# EAGLE design NobleAward_Rhodium (EAGLE 9.6.2)
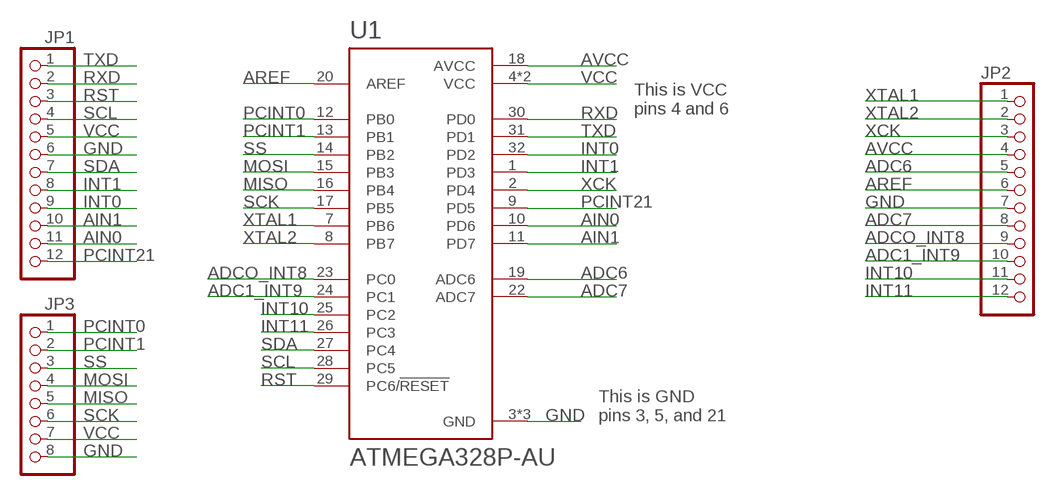
[diagram p0: schematic, sheet 1]

## Parts
JP1  PINHD-1X12  [1X12]
JP2  PINHD-1X12  [1X12]
JP3  PINHD-1X8  [1X08]
U1  ATMEGA328P-AU  [QFP80P900X900X120-32N]

## Nets
ADC1_INT9: JP2.10 U1.24(PC1)
ADC6: JP2.5 U1.19(ADC6)
ADC7: JP2.8 U1.22(ADC7)
ADCO_INT8: JP2.9 U1.23(PC0)
AIN0: JP1.11 U1.10(PD6)
AIN1: JP1.10 U1.11(PD7)
AREF: JP2.6 U1.20(AREF)
AVCC: JP2.4 U1.18(AVCC)
GND: JP1.6 JP2.7 JP3.8 U1.3(GND) U1.5(GND) U1.21(GND)
INT0: JP1.9 U1.32(PD2)
INT1: JP1.8 U1.1(PD3)
INT10: JP2.11 U1.25(PC2)
INT11: JP2.12 U1.26(PC3)
MISO: JP3.5 U1.16(PB4)
MOSI: JP3.4 U1.15(PB3)
PCINT0: JP3.1 U1.12(PB0)
PCINT1: JP3.2 U1.13(PB1)
PCINT21: JP1.12 U1.9(PD5)
RST: JP1.3 U1.29(PC6/!RESET)
RXD: JP1.2 U1.30(PD0)
SCK: JP3.6 U1.17(PB5)
SCL: JP1.4 U1.28(PC5)
SDA: JP1.7 U1.27(PC4)
SS: JP3.3 U1.14(PB2)
TXD: JP1.1 U1.31(PD1)
VCC: JP1.5 JP3.7 U1.4(VCC) U1.6(VCC)
XCK: JP2.3 U1.2(PD4)
XTAL1: JP2.1 U1.7(PB6)
XTAL2: JP2.2 U1.8(PB7)

## Notes on the sheet
- This is VCC
  pins 4 and 6
- This is GND
  pins 3, 5, and 21

## Library data of the parts
JP1 JP2 = pinhead:PINHD-1X12: PIN HEADER
JP3 = pinhead:PINHD-1X8: PIN HEADER
U1 = ATMEGA328P-AU:ATMEGA328P-AU: ATmega Series 20 MHz 32 KB Flash 2 KB SRAM 8-Bit Microcontroller - TQFP-32; AVAILABILITY: Unavailable; DESCRIPTION: AVR AVR® ATmega Microcontroller IC 8-Bit 20MHz 32KB _16K x 16_ FLASH 32-TQFP _7x7_; MF: Microchip; MP: ATMEGA328P-AU; PACKAGE: TQFP-32 Microchip; PRICE: None

## Board
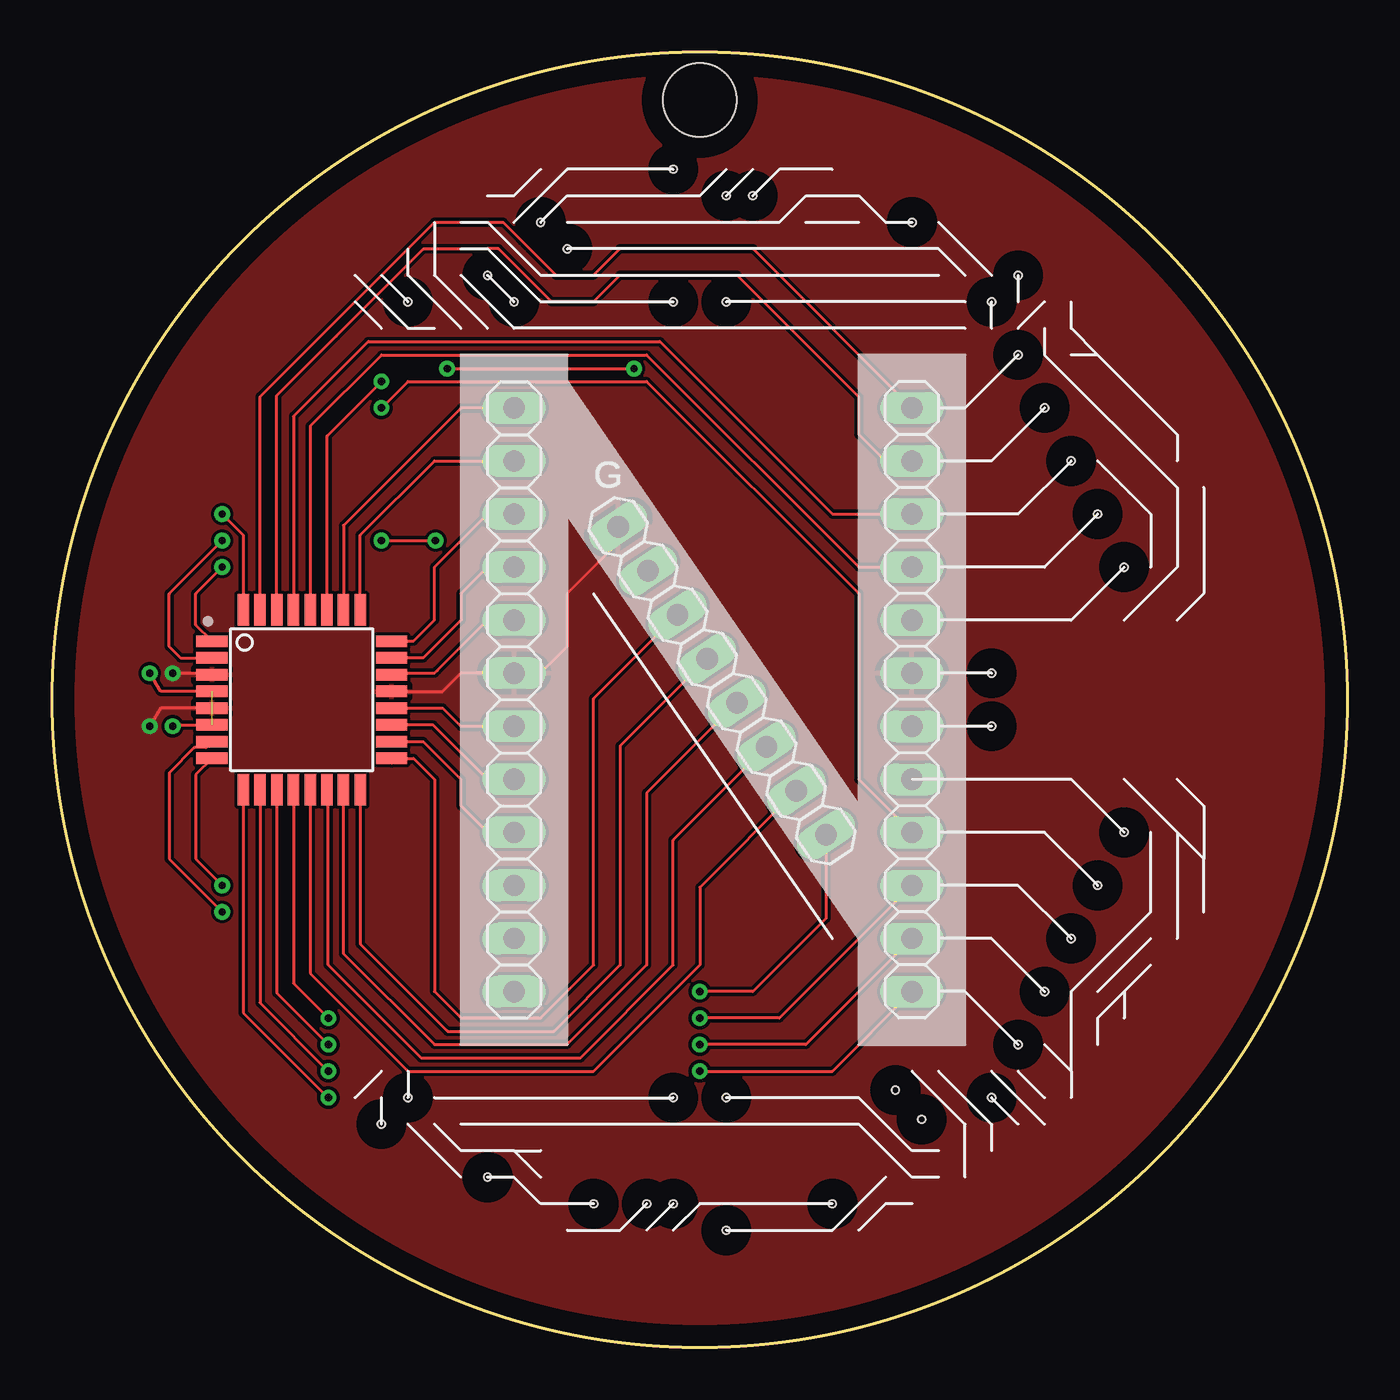
[diagram p1: board, top side]
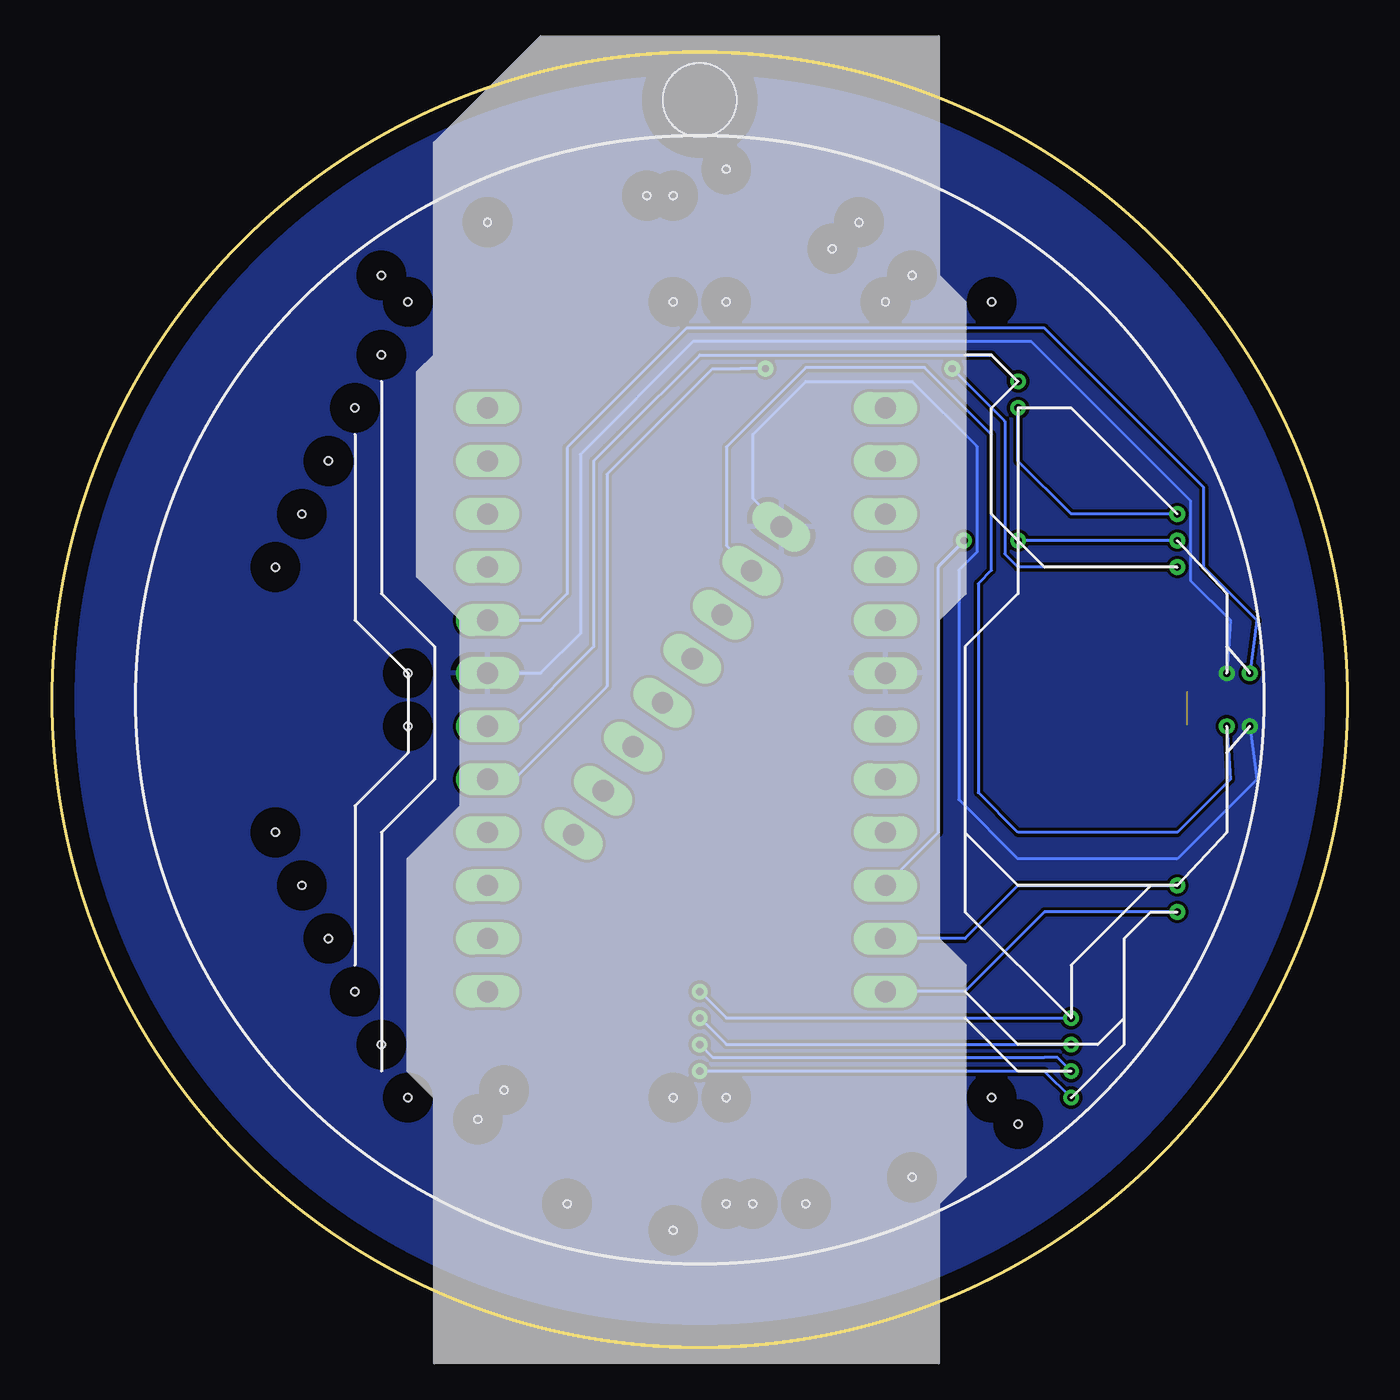
[diagram p2: board, bottom side, seen from below]

Size 62 x 62 mm. Coordinates in mm from the lower left corner, seen from the top.
Outline: circle at 31,31 radius 31
Copper layers (1*16): Top 0.035mm / dielectric 1.5mm / Bottom 0.035mm
Design rules "default": minimum track width 6mil, minimum drill 0.35mm, track to track 6mil, track to pad 6mil, pad to pad 6mil, via to via 6mil, smd to smd 6mil, copper to edge 40mil, drill to drill 6mil, minimum pad ring 10mil, minimum via ring 8mil, stop-mask expansion 4mil, vias tented up to drill 0mil, thermal gap 10mil
Holes 0.35 mm at 24.65,52.59 41.16,53.86 23.38,53.86 33.54,55.13 32.27,55.13 22.11,50.05 29.73,50.05 32.27,50.05 29.73,56.4 20.84,51.32 17.03,50.05 44.97,50.05 46.24,51.32 20.84,8.14 28.46,6.87 29.73,6.87 40.37,12.31 32.27,11.95 29.73,11.95 32.27,5.6 41.62,10.91 44.97,11.95 17.03,11.95 15.76,10.68 25.92,6.87 37.35,6.87 46.24,47.51 47.51,44.97 48.78,42.43 50.05,39.89 51.32,37.35 44.97,32.27 44.97,29.73 51.32,24.65 50.05,22.11 48.78,19.57 47.51,17.03 46.24,14.49
Holes 3.5 mm at 31,59.71

### Footprints (pad centres in the part's own frame; a part is rotated, then mirrored left to right if it is on the bottom)
1X12 = drill 1.016 long: 1 -13.97,0; 2 -11.43,0; 3 -8.89,0; 4 -6.35,0; 5 -3.81,0; 6 -1.27,0; 7 1.27,0; 8 3.81,0; 9 6.35,0; 10 8.89,0; 11 11.43,0; 12 13.97,0
1X08 = drill 1.016 long: 1 -8.89,0; 2 -6.35,0; 3 -3.81,0; 4 -1.27,0; 5 1.27,0; 6 3.81,0; 7 6.35,0; 8 8.89,0
QFP80P900X900X120-32N = smd 1.5 x 0.55: 1 -4.3,2.8; 2 -4.3,2; 3 -4.3,1.2; 4 -4.3,0.4; 5 -4.3,-0.4; 6 -4.3,-1.2; 7 -4.3,-2; 8 -4.3,-2.8; 17 4.3,-2.8; 18 4.3,-2; 19 4.3,-1.2; 20 4.3,-0.4; 21 4.3,0.4; 22 4.3,1.2; 23 4.3,2; 24 4.3,2.8 | smd 0.55 x 1.5: 9 -2.8,-4.3; 10 -2,-4.3; 11 -1.2,-4.3; 12 -0.4,-4.3; 13 0.4,-4.3; 14 1.2,-4.3; 15 2,-4.3; 16 2.8,-4.3; 25 2.8,4.3; 26 2,4.3; 27 1.2,4.3; 28 0.4,4.3; 29 -0.4,4.3; 30 -1.2,4.3; 31 -2,4.3; 32 -2.8,4.3

### Placement (x,y rotation side)
JP1  41.16,31 270 top
JP2  22.11,31 90 top
JP3  32.07,31.91 124 top
U1  11.95,31 0 top

### Tracks (layer width: path | path; a pad name or v marks a point on that pad's centre or on a via)
ADC1_INT9
  Top 0.152: 16.98,33.8 U1.24 17.29,33.8 18.3,34.81 18.3,37.35 20.84,39.89 JP2.10
ADC6
  Top 0.152: U1.19 18.23,29.8 20.84,27.19 JP2.5
ADC7
  Top 0.152: JP2.8 20.84,34.81 18.43,32.4 18.3,32.27 16.32,32.27 U1.22
ADCO_INT8
  Top 0.152: U1.23 17.76,33 19.57,34.81 19.57,36.08 20.84,37.35 JP2.9
AIN0  (via drill 0.35)
  Top 0.152: U1.10 9.95,16.49 v13.22,13.22 | JP1.11 36.08,14.49 v31,14.49
  Bottom 0.152: v31,14.49 30.39,13.88 14.49,13.88 13.88,13.88 v13.22,13.22
AIN1  (via drill 0.35)
  Top 0.152: U1.11 10.75,16.96 11.95,15.76 v13.22,14.49 | JP1.10 34.81,15.76 v31,15.76
  Bottom 0.152: v31,15.76 29.73,14.49 v13.22,14.49
AREF
  Top 0.152: U1.20 18.7,30.6 19.57,29.73 JP2.6
AVCC
  Top 0.152: U1.18 17.76,29 18.3,28.46 19.57,27.19 19.57,25.92 20.84,24.65 JP2.4
GND  (via drill 0.35)
  Top 0.152: U1.5 5.2,30.6 v4.67,29.73 | U1.21 18.7,31.4 19.57,32.27 JP2.7 23.38,32.27 24.65,33.54 24.65,36.08 27.1,38.53 JP3.8 | v5.77,32.27 7.58,32.27 U1.3
  Bottom 0.152: v5.77,32.27 5.6,34.81 7.51,36.72 7.51,40.52 15.13,48.15 31.32,48.15 36.72,42.75 36.72,34.18 38.62,32.27 JP1.6 | v4.67,29.73 4.33,27.19 8.14,23.38 15.76,23.38 18.61,26.23 18.61,37.2 17.74,38.06 17.74,43.14 20.84,46.24 25.92,46.24 28.46,43.7 28.46,40.64 JP3.8
  pour Bottom: 17.03,62.75 47.51,62.75 50.05,60.21 62.75,47.51 62.75,19.57 62.75,17.03 44.97,-0.75 19.57,-0.75 15.76,-0.75 -2.02,17.03 -2.02,20.84 -2.02,44.97 15.76,62.75
  pour Top: 13.22,62.75 46.24,62.75 62.75,46.24 62.75,15.76 46.24,-0.75 14.49,-0.75 -0.75,14.49 -0.75,48.78
INT0  (via drill 0.35)
  Top 0.152: v8.14,39.89 9.15,38.88 U1.32 | JP1.9 38.62,27.19 38.62,36.08 28.46,46.24 17.03,46.24 v15.76,44.97
  Bottom 0.152: v8.14,39.89 13.22,39.89 15.76,42.43 v15.76,44.97
INT1  (via drill 0.35)
  Top 0.152: U1.1 6.87,34.58 6.87,36.08 v8.14,37.35 | v18.91,46.85 19.57,46.85 v27.85,46.85
  Bottom 0.152: v8.14,37.35 15.76,37.35 16.4,37.98 16.4,44.34 v18.91,46.85 | JP1.8 39.89,27.19 35.45,31.63 35.45,41.8 30.39,46.85 29.73,46.85 29.07,46.85 v27.85,46.85
INT10
  Top 0.152: U1.25 14.75,38.88 18.3,42.43 JP2.11
INT11
  Top 0.152: JP2.12 19.57,44.97 13.95,39.35 U1.26
MISO
  Top 0.152: U1.16 14.75,19.31 18.94,15.12 24.02,15.12 27.19,18.3 27.19,28.79 JP3.5
MOSI
  Top 0.152: U1.15 13.95,18.84 18.3,14.49 24.65,14.49 28.46,18.3 28.46,26.54 JP3.4
PCINT0  (via drill 0.35)
  Top 0.152: U1.12 11.55,17.43 v13.22,15.76 | JP3.1 37.04,23.07 37.04,20.53 33.54,17.03 v31,17.03
  Bottom 0.152: v13.22,15.76 29.73,15.76 v31,17.03
PCINT1
  Top 0.152: U1.13 12.35,17.9 17.03,13.22 25.92,13.22 31,18.3 31,22.03 JP3.2
PCINT21  (via drill 0.35)
  Top 0.152: U1.9 9.15,16.02 v13.22,11.95 | v31,13.22 37.35,13.22 JP1.12
  Bottom 0.152: v13.22,11.95 14.49,13.22 v31,13.22
RST
  Top 0.152: U1.29 11.55,44.57 15.13,48.15 29.1,48.15 37.35,39.89 JP1.3
RXD
  Top 0.152: JP1.2 39.89,42.43 38.62,43.7 38.62,45.49 32.79,51.32 27.19,51.32 25.92,50.05 23.9,50.05 21.37,52.59 20.84,52.59 17.78,52.59 13.59,48.41 10.75,45.56 U1.30
SCK
  Top 0.152: 16.25,27.97 U1.17 17.29,28.2 18.3,27.19 18.3,17.03 19.57,15.76 23.38,15.76 25.92,18.3 25.92,31.05 JP3.6
SCL
  Top 0.152: U1.28 12.35,44.1 15.76,47.51 28.46,47.51 38.62,37.35 JP1.4
SDA  (via drill 0.35)
  Top 0.152: U1.27 13.15,43.63 v15.76,46.24
  Bottom 0.152: JP1.7 39.89,29.73 36.08,33.54 36.08,42.43 35.45,43.06 34.81,43.7 31,47.51 17.03,47.51 v15.76,46.24
SS
  Top 0.152: U1.14 13.22,26.63 13.22,18.3 17.66,13.86 25.29,13.86 29.73,18.3 29.73,24.28 JP3.3
TXD
  Top 0.152: U1.31 9.95,45.51 18.3,53.86 21.59,53.86 22.48,52.96 22.86,52.59 23.75,51.69 24.12,51.32 25.92,51.32 27.19,52.59 33.54,52.59 JP1.1
VCC  (via drill 0.35)  (1 unrouted)
  Top 0.152: U1.4 5.2,31.4 v4.67,32.27 | 5.67,29.8 v5.77,29.73 5.84,29.8 U1.6
  Bottom 0.152: v4.67,32.27 4.33,34.81 6.87,37.35 6.87,41.16 14.49,48.78 31.64,48.78 37.35,43.06 37.35,36.08 38.62,34.81 JP1.5 | v5.77,29.73 5.6,27.19 8.14,24.65 15.76,24.65 17.66,26.55 17.66,36.56 17.03,37.2 17.03,43.7 20.24,46.91 25.92,46.91 29.73,43.1 29.73,38.38 JP3.7
XCK  (via drill 0.35)
  Top 0.152: U1.2 6.14,33 5.6,33.54 5.6,36.08 v8.14,38.62 | v15.76,38.62 v18.35,38.62
  Bottom 0.152: JP2.3 19.57,24.65 19.57,37.35 | 19.57,37.35 18.3,38.62 | v8.14,38.62 v15.76,38.62 | v18.35,38.62 19.57,37.4 19.57,37.35
XTAL1  (via drill 0.35)
  Top 0.152: U1.7 7.35,28.7 6.81,28.7 5.6,27.5 5.6,23.38 v8.14,20.84
  Bottom 0.152: JP2.1 18.3,17.03 14.49,20.84 v8.14,20.84
XTAL2  (via drill 0.35)
  Top 0.152: U1.8 6.87,27.42 6.87,23.38 v8.14,22.11
  Bottom 0.152: JP2.2 18.3,19.57 15.76,22.11 v8.14,22.11

### Text on the board
tPlace: G | G | G | G | G | G | G | G
tStop: VmV | mFt | uaX | R1c | RlI | JpcH | BzY3 | NOBEL / PRIZE | G1lb | Glvc | mVtI | lci | IHB | <Insert Text> | HNlY | GVt | 3Vya | XRhd
bStop: 1 | N | 1 | 1 | 0 | G | 1 | R | 1 | <Insert> / <Text> | 1 | B | MMXXI | 0 | 0 | X | 3 | 1 | 0 | -... .-.. --- --. | L | 1